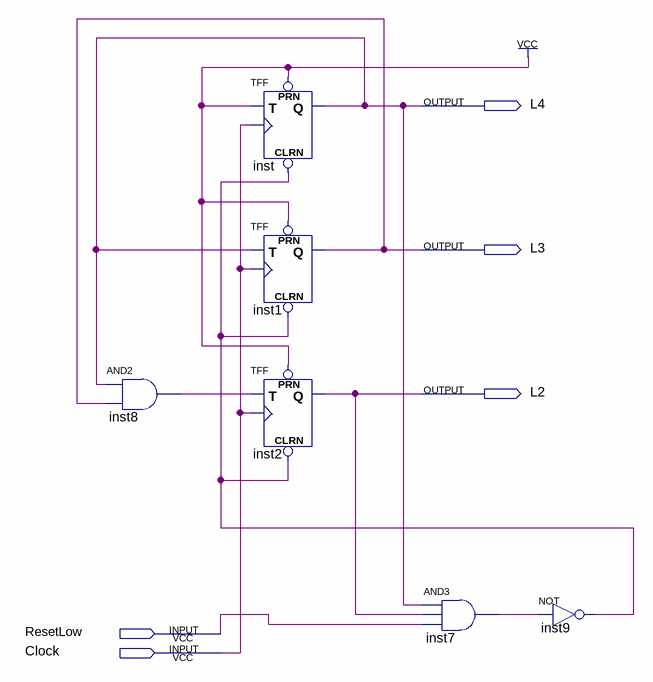
[diagram p0: schematic sheet]
// Quartus schematic question62.bdf as structural Verilog: 6 symbols, 5 pins
module question62 (
  input  ResetLow,
  input  Clock,
  output L4,
  output L3,
  output L2
);

  wire inst7_out, inst8_out, inst9_out;

  and inst8 (inst8_out, L4, L3);
  TFF inst (.PRN(1'b1), .CLRN(inst9_out), .T(1'b1), .CLK(Clock), .Q(L4));
  TFF inst1 (.PRN(1'b1), .CLRN(inst9_out), .T(L4), .CLK(Clock), .Q(L3));
  TFF inst2 (.PRN(1'b1), .CLRN(inst9_out), .T(inst8_out), .CLK(Clock), .Q(L2));
  and inst7 (inst7_out, L4, L2, ResetLow);
  not inst9 (inst9_out, inst7_out);
endmodule
